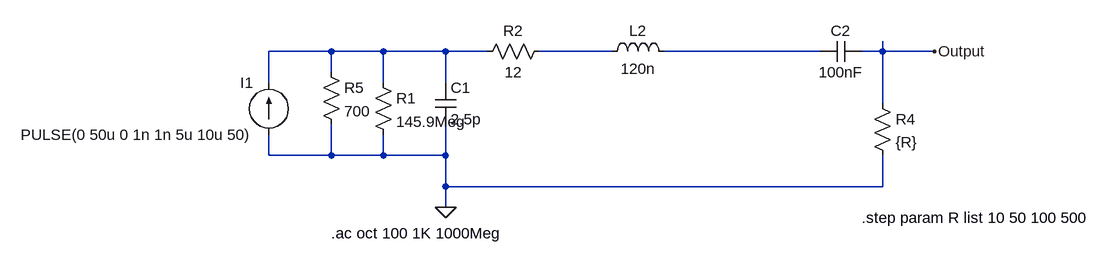
[diagram p0: schematic Draft34.asc]
Draft34.asc, the LTspice schematic file:
Version 4
SHEET 1 1228 680
WIRE 48 256 -48 256
WIRE 128 256 48 256
WIRE 224 256 128 256
WIRE 288 256 224 256
WIRE 480 256 368 256
WIRE 800 256 560 256
WIRE 896 256 896 240
WIRE 896 256 864 256
WIRE 976 256 896 256
WIRE 48 288 48 256
WIRE -48 304 -48 256
WIRE 128 304 128 256
WIRE 224 304 224 256
WIRE 896 336 896 256
WIRE -48 416 -48 384
WIRE 48 416 48 368
WIRE 48 416 -48 416
WIRE 128 416 128 384
WIRE 128 416 48 416
WIRE 224 416 224 368
WIRE 224 416 128 416
WIRE 224 464 224 416
WIRE 896 464 896 416
WIRE 896 464 224 464
WIRE 224 496 224 464
FLAG 224 496 0
FLAG 976 256 Output
SYMBOL res 112 288 R0
SYMATTR InstName R1
SYMATTR Value 145.9Meg
SYMBOL cap 208 304 R0
SYMATTR InstName C1
SYMATTR Value 2.5p
SYMBOL res 384 240 R90
WINDOW 0 0 56 VBottom 2
WINDOW 3 32 56 VTop 2
SYMATTR InstName R2
SYMATTR Value 12
SYMBOL current -48 384 R180
WINDOW 3 24 0 Left 2
WINDOW 0 24 80 Left 2
SYMATTR Value PULSE(0 50u 0 1n 1n 5u 10u 50)
SYMATTR InstName I1
SYMATTR Value2 AC .5u 0
SYMBOL Cap 864 240 R90
WINDOW 0 0 32 VBottom 2
WINDOW 3 32 32 VTop 2
SYMATTR InstName C2
SYMATTR Value 100nF
SYMBOL ind 464 272 R270
WINDOW 0 32 56 VTop 2
WINDOW 3 5 56 VBottom 2
SYMATTR InstName L2
SYMATTR Value 120n
SYMBOL Res 880 320 R0
SYMATTR InstName R4
SYMATTR Value {R}
SYMBOL res 32 272 R0
SYMATTR InstName R5
SYMATTR Value 700
TEXT 48 536 Left 2 !.ac oct 100 1K 1000Meg
TEXT 864 512 Left 2 !.step param R list 10 50 100 500

The netlist it stands for:
* Draft34.asc
R1 N001 0 145.9Meg
C1 N001 0 2.5p
R2 N002 N001 12
I1 0 N001 PULSE(0 50u 0 1n 1n 5u 10u 50) AC .5u 0
C2 Output N003 100nF
L2 N002 N003 120n
R4 Output 0 {R}
R5 N001 0 700
.ac oct 100 1K 1000Meg
.step param R list 10 50 100 500
.backanno
.end